# Altium schematic sheet ultrasoon sensor.SchDoc
size A
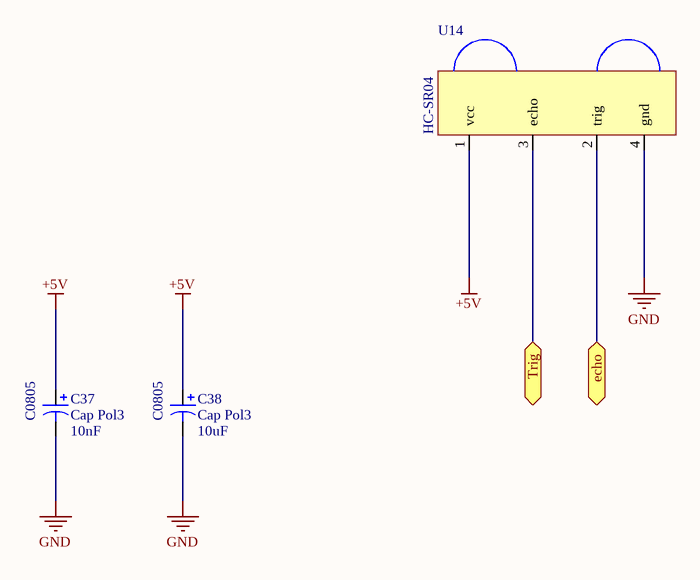
[diagram p0: ultrasoon sensor.SchDoc]

## Parts
C37  Cap Pol3  value 10nF  [C0805]
C38  Cap Pol3  value 10uF  [C0805]
U14  HC-SR04  [ultrasoonSensor]

## Ports
echo, Trig

## Nets
+5V: C37.1 C38.1 U14.1(vcc)
GND: C37.2 C38.2 U14.4(gnd)
echo: U14.2(trig) ; port echo
Trig: U14.3(echo) ; port Trig

## Library data of the parts
C37 C38 = Cap Pol3: Polarized Capacitor (Surface Mount); Published: 8-Jun-2000; LatestRevisionDate: 29-May-2009; LatestRevisionNote: IPC-7351 Footprint Added.; PackageReference: C0805; Publisher: Altium Limited; PackageDescription: Chip Capacitor